# Altium schematic sheet Sheet1.SchDoc
size A3
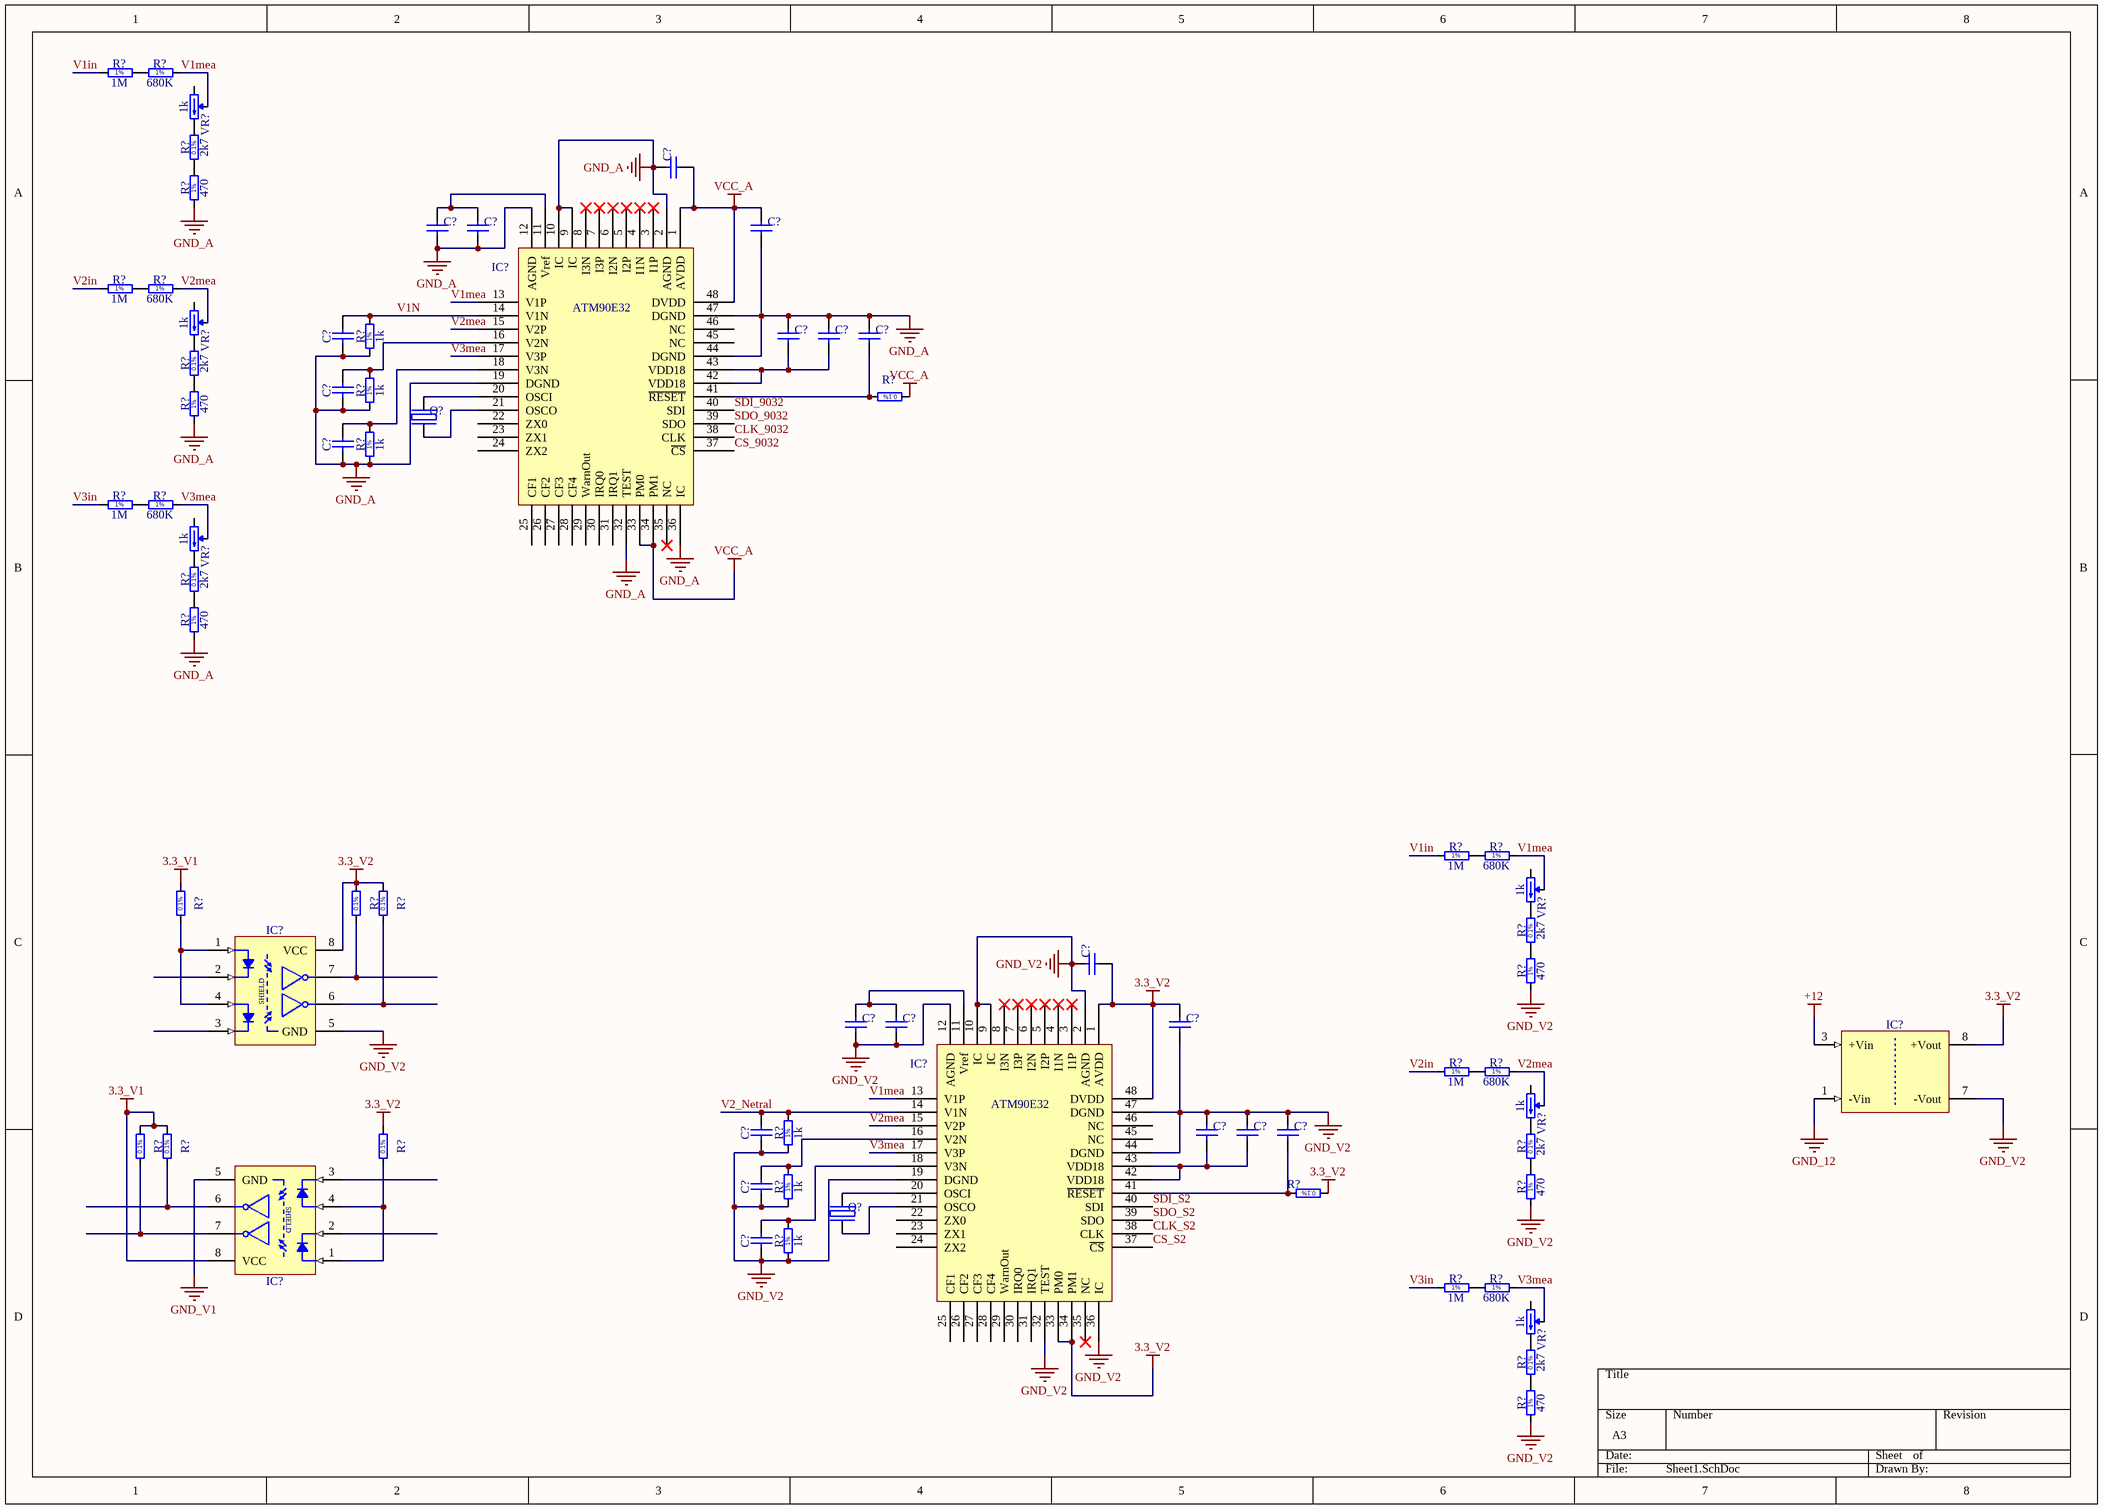
[diagram p0: Sheet1.SchDoc]

## Parts
(Parts that share a designator on the sheet are numbered #1, #2 ... from top to bottom, then left to right.)
C?#1  0.1uf  [CAPC2012X135N]  (value not drawn)
C?#2  0.1uf  [CAPC2012X135N]  (value not drawn)
C?#3  0.1uf  [CAPC2012X135N]  (value not drawn)
C?#4  4.7uf  [CAPC2012X135N]  (value not drawn)
C?#5  0.1uf  [CAPC2012X135N]  (value not drawn)
C?#6  0.1uf  [CAPC2012X135N]  (value not drawn)
C?#7  18nf  [CAPC2012X135N]  (value not drawn)
C?#8  10uf  [CAPC2012X135N]  (value not drawn)
C?#9  18nf  [CAPC2012X135N]  (value not drawn)
C?#10  18nf  [CAPC2012X135N]  (value not drawn)
C?#11  0.1uf  [CAPC2012X135N]  (value not drawn)
C?#12  0.1uf  [CAPC2012X135N]  (value not drawn)
C?#13  0.1uf  [CAPC2012X135N]  (value not drawn)
C?#14  4.7uf  [CAPC2012X135N]  (value not drawn)
C?#15  0.1uf  [CAPC2012X135N]  (value not drawn)
C?#16  0.1uf  [CAPC2012X135N]  (value not drawn)
C?#17  18nf  [CAPC2012X135N]  (value not drawn)
C?#18  10uf  [CAPC2012X135N]  (value not drawn)
C?#19  18nf  [CAPC2012X135N]  (value not drawn)
C?#20  18nf  [CAPC2012X135N]  (value not drawn)
IC?#1  ATM90E32  [48A_N]
IC?#2  HCPL-2631S  [SOIC254P1030X508-8N]  (value not drawn)
IC?#3  TES 1-0511  [DCDC_TRACO_TES1-XX1X]  (value not drawn)
IC?#4  ATM90E32  [48A_N]
IC?#5  HCPL-2631S  [SOIC254P1030X508-8N]  (value not drawn)
Q?#1  16.384Mhz  [XTAL1160X490X430]  (value not drawn)
Q?#2  16.384Mhz  [XTAL1160X490X430]  (value not drawn)
R?#1  1M  [RES1016-630X250]
R?#2  680K  [RES1016-630X250]
R?#3  2k7  [RESC2012X60N]
R?#4  470  [RESC2012X60N]
R?#5  1M  [RES1016-630X250]
R?#6  680K  [RES1016-630X250]
R?#7  1k  [RESC2012X60N]
R?#8  2k7  [RESC2012X60N]
R?#9  10k  [RESC2012X60N]  (value not drawn)
R?#10  1k  [RESC2012X60N]
R?#11  470  [RESC2012X60N]
R?#12  1k  [RESC2012X60N]
R?#13  1M  [RES1016-630X250]
R?#14  680K  [RES1016-630X250]
R?#15  2k7  [RESC2012X60N]
R?#16  470  [RESC2012X60N]
R?#17  1M  [RES1016-630X250]
R?#18  680K  [RES1016-630X250]
R?#19  10k  [RESC2012X60N]  (value not drawn)
R?#20  10k  [RESC2012X60N]  (value not drawn)
R?#21  10k  [RESC2012X60N]  (value not drawn)
R?#22  2k7  [RESC2012X60N]
R?#23  470  [RESC2012X60N]
R?#24  1M  [RES1016-630X250]
R?#25  680K  [RES1016-630X250]
R?#26  1k  [RESC2012X60N]
R?#27  10k  [RESC2012X60N]  (value not drawn)
R?#28  10k  [RESC2012X60N]  (value not drawn)
R?#29  10k  [RESC2012X60N]  (value not drawn)
R?#30  2k7  [RESC2012X60N]
R?#31  10k  [RESC2012X60N]  (value not drawn)
R?#32  1k  [RESC2012X60N]
R?#33  470  [RESC2012X60N]
R?#34  1k  [RESC2012X60N]
R?#35  1M  [RES1016-630X250]
R?#36  680K  [RES1016-630X250]
R?#37  2k7  [RESC2012X60N]
R?#38  470  [RESC2012X60N]
VR?#1  1k  [VR5]
VR?#2  1k  [VR5]
VR?#3  1k  [VR5]
VR?#4  1k  [VR5]
VR?#5  1k  [VR5]
VR?#6  1k  [VR5]

## Nets
3.3_V1: IC?#5.8(VCC) R?#19.2 R?#27.2 R?#28.2
3.3_V2: C?#11.2 C?#13.1 IC?#2.8(VCC) IC?#3.8(+Vout) IC?#4.1(AVDD) IC?#4.33(PM0) IC?#4.34(PM1) IC?#4.48(DVDD) R?#20.2 R?#21.2 R?#29.2 R?#31.1
+12: IC?#3.3(+Vin)
GND_12: IC?#3.1(-Vin)
GND_A: C?#1.1 C?#2.2 C?#3.2 C?#4.1 C?#5.1 C?#6.1 C?#7.1 C?#8.2 C?#9.1 C?#10.1 IC?#1.2(AGND) IC?#1.9(IC) IC?#1.10(IC) IC?#1.12(AGND) IC?#1.19(DGND) IC?#1.32(TEST) IC?#1.36(IC) IC?#1.44(DGND) IC?#1.47(DGND) R?#4.1 R?#7.1 R?#10.1 R?#11.1 R?#12.1 R?#16.1
GND_V1: IC?#5.5(GND)
GND_V2: C?#11.1 C?#12.2 C?#13.2 C?#14.1 C?#15.1 C?#16.1 C?#17.1 C?#18.2 C?#19.1 C?#20.1 IC?#2.5(GND) IC?#3.7(-Vout) IC?#4.2(AGND) IC?#4.9(IC) IC?#4.10(IC) IC?#4.12(AGND) IC?#4.19(DGND) IC?#4.32(TEST) IC?#4.36(IC) IC?#4.44(DGND) IC?#4.47(DGND) R?#23.1 R?#26.1 R?#32.1 R?#33.1 R?#34.1 R?#38.1
VCC_A: C?#1.2 C?#3.1 IC?#1.1(AVDD) IC?#1.33(PM0) IC?#1.34(PM1) IC?#1.48(DVDD) R?#9.1
CLK_9032: IC?#1.38(CLK)
CLK_S2: IC?#4.38(CLK)
CS_9032: IC?#1.37(~{CS})
CS_S2: IC?#4.37(~{CS})
SDI_9032: IC?#1.40(SDI)
SDI_S2: IC?#4.40(SDI)
SDO_9032: IC?#1.39(SDO)
SDO_S2: IC?#4.39(SDO)
V1in: R?#1.1 R?#17.1
V1mea: IC?#1.13(V1P) IC?#4.13(V1P) R?#2.2 R?#18.2 VR?#1.2(W) VR?#4.2(W)
V1N: C?#7.2 IC?#1.14(V1N) R?#7.2
V2_Netral: C?#17.2 IC?#4.14(V1N) R?#26.2
V2in: R?#5.1 R?#24.1
V2mea: IC?#1.15(V2P) IC?#4.15(V2P) R?#6.2 R?#25.2 VR?#2.2(W) VR?#5.2(W)
V3in: R?#13.1 R?#35.1
V3mea: IC?#1.17(V3P) IC?#4.17(V3P) R?#14.2 R?#36.2 VR?#3.2(W) VR?#6.2(W)
NetC?#2_1: C?#2.1 C?#4.2 IC?#1.11(Vref)
NetC?#5_2: C?#5.2 C?#8.1 IC?#1.42(VDD18) IC?#1.43(VDD18)
NetC?#6_2: C?#6.2 IC?#1.41(~{RESET}) R?#9.2
NetC?#9_2: C?#9.2 IC?#1.16(V2N) R?#10.2
NetC?#10_2: C?#10.2 IC?#1.18(V3N) R?#12.2
NetC?#12_1: C?#12.1 C?#14.2 IC?#4.11(Vref)
NetC?#15_2: C?#15.2 C?#18.1 IC?#4.42(VDD18) IC?#4.43(VDD18)
NetC?#16_2: C?#16.2 IC?#4.41(~{RESET}) R?#31.2
NetC?#19_2: C?#19.2 IC?#4.16(V2N) R?#32.2
NetC?#20_2: C?#20.2 IC?#4.18(V3N) R?#34.2
NetIC?#1_20: IC?#1.20(OSCI) Q?#1.1(OSC1)
NetIC?#1_21: IC?#1.21(OSCO) Q?#1.2(OSC2)
NetIC?#2_1: IC?#2.1(A1) IC?#2.4(A2) R?#19.1
NetIC?#2_6: IC?#2.6(VO2) R?#21.1
NetIC?#2_7: IC?#2.7(VO1) R?#20.1
NetIC?#4_20: IC?#4.20(OSCI) Q?#2.1(OSC1)
NetIC?#4_21: IC?#4.21(OSCO) Q?#2.2(OSC2)
NetIC?#5_1: IC?#5.1(A1) IC?#5.4(A2) R?#29.1
NetIC?#5_6: IC?#5.6(VO2) R?#28.1
NetIC?#5_7: IC?#5.7(VO1) R?#27.1
NetR?#1_2: R?#1.2 R?#2.1
NetR?#3_1: R?#3.1 R?#4.2
NetR?#3_2: R?#3.2 VR?#1.3(CW)
NetR?#5_2: R?#5.2 R?#6.1
NetR?#8_1: R?#8.1 R?#11.2
NetR?#8_2: R?#8.2 VR?#2.3(CW)
NetR?#13_2: R?#13.2 R?#14.1
NetR?#15_1: R?#15.1 R?#16.2
NetR?#15_2: R?#15.2 VR?#3.3(CW)
NetR?#17_2: R?#17.2 R?#18.1
NetR?#22_1: R?#22.1 R?#23.2
NetR?#22_2: R?#22.2 VR?#4.3(CW)
NetR?#24_2: R?#24.2 R?#25.1
NetR?#30_1: R?#30.1 R?#33.2
NetR?#30_2: R?#30.2 VR?#5.3(CW)
NetR?#35_2: R?#35.2 R?#36.1
NetR?#37_1: R?#37.1 R?#38.2
NetR?#37_2: R?#37.2 VR?#6.3(CW)

Not connected (* = marked no-connect by the designer): IC?#1 3(I1P)* 4(I1N)* 5(I2P)* 6(I2N)* 7(I3P)* 8(I3N)* 22(ZX0) 23(ZX1) 24(ZX2) 25(CF1) 26(CF2) 27(CF3) 28(CF4) 29(WarnOut) 30(IRQ0) 31(IRQ1) 35(NC)* 45(NC) 46(NC); IC?#2 2(C1) 3(C2); IC?#4 3(I1P)* 4(I1N)* 5(I2P)* 6(I2N)* 7(I3P)* 8(I3N)* 22(ZX0) 23(ZX1) 24(ZX2) 25(CF1) 26(CF2) 27(CF3) 28(CF4) 29(WarnOut) 30(IRQ0) 31(IRQ1) 35(NC)* 45(NC) 46(NC); IC?#5 2(C1) 3(C2); VR?#1 1(CCW); VR?#2 1(CCW); VR?#3 1(CCW); VR?#4 1(CCW); VR?#5 1(CCW); VR?#6 1(CCW)

## Notes on the sheet
- (in symbol HCPL-2631S) SHIELD
- (in symbol R0805_1K_1%_0.125W_100PPM) 1%
- (in symbol R0805_2K7_0.1%_0.125W_25PPM) 0.1%
- (in symbol R0805_10K_0.1%_0.1W_10PPM) 0.1%
- (in symbol R0805_470R_1%_0.125W_100PPM) 1%
- (in symbol RMF_1M_1%_0.6W_50PPM_1016-630X250) 1%
- (in symbol RMF_680K_1%_0.6W_50PPM_1016-630X250) 1%

## Library data of the parts
C?#1-C?#3 C?#5 C?#6 C?#11-C?#13 C?#15 C?#16 = CC0805_100NF_50V_10%_X7R: 0092-0004-8; Part Description: SMD Multilayer Chip Ceramic Capacitor; Manufacturer: GENERIC; Manufacturer1 Part Number: B37941K5104K62; Value: 100nF; Voltage: 50V; TC: X7R; Tolerance: ±10%; Table: Capacitors SMD; Part Number: CC0805_100NF_50V_10%_X7R; Component Kind: Standard; Component Type: Standard; Pin Count: 2; Status: Preferred; Manufacturer Part Number: CC0805_100NF_50V_10%_X7R; Case: 0805; Mounted: Yes; Socket: No; SMD: Yes; Manufacturer1 Example: EPCOS; Manufacturer1 ComponentHeight: 1.35mm; HelpURL: \\cern.ch\dfs\Applications\Altium\Datasheets\CC0805_X7R_EPCOS.pdf; Author: CERN DEM JLC; CreateDate: 3/12/2550; LatestRevisionDate: 3/12/2550
C?#4 C?#14 = CC0805_4.7UF_10V_10%_X5R: 0160-0457-5; Part Description: SMD Multilayer Chip Ceramic Capacitor; Manufacturer: GENERIC; Manufacturer1 Part Number: 222224013672; Voltage: 10V; TC: X5R; Tolerance: ±10%; Table: Capacitors SMD; Part Number: CC0805_4.7UF_10V_10%_X5R; Component Kind: Standard; Component Type: Standard; Pin Count: 2; Value: 4.7uF; Status: Preferred; Manufacturer Part Number: CC0805_4.7UF_10V_10%_X5R; Case: 0805; Mounted: Yes; Socket: No; SMD: Yes; Manufacturer1 Example: PHYCOMP; Manufacturer1 ComponentHeight: 1.45mm; HelpURL: \\cern.ch\dfs\Applications\Altium\Datasheets\CC0805_X5R_PHYCOMP_HC.pdf; Author: CERN DEM JLC; CreateDate: 3/12/2550; LatestRevisionDate: 3/12/2550
C?#7 C?#9 C?#10 C?#17 C?#19 C?#20 = CC0805_18NF_50V_10%_X7R: 0328-0120-2; Part Description: SMD Multilayer Chip Ceramic Capacitor; Manufacturer: GENERIC; Manufacturer1 Part Number: 223858615639; Voltage: 50V; TC: X7R; Tolerance: ±10%; Table: Capacitors SMD; Part Number: CC0805_18NF_50V_10%_X7R; Component Kind: Standard; Component Type: Standard; Pin Count: 2; Value: 18nF; Status: Preferred; Manufacturer Part Number: CC0805_18NF_50V_10%_X7R; Case: 0805; Mounted: Yes; Socket: No; SMD: Yes; Manufacturer1 Example: PHYCOMP; Manufacturer1 ComponentHeight: 1.35mm; HelpURL: \\cern.ch\dfs\Applications\Altium\Datasheets\CC0805_X7R_PHYCOMP.pdf; Author: CERN DEM JLC; CreateDate: 3/12/2550; LatestRevisionDate: 3/12/2550
C?#8 C?#18 = CC0805_10UF_10V_10%_X7R: 0328-0108-8; Part Description: SMD Multilayer Chip Ceramic Capacitor; Manufacturer: GENERIC; Manufacturer1 Part Number: GRM21BR71A106KE51L; Voltage: 10V; TC: X7R; Tolerance: ±10%; Table: Capacitors SMD; Part Number: CC0805_10UF_10V_10%_X7R; Component Kind: Standard; Component Type: Standard; Pin Count: 2; Value: 10uF; Status: Preferred; Manufacturer Part Number: CC0805_10UF_10V_10%_X7R; Case: 0805; Mounted: Yes; Socket: No; SMD: Yes; Manufacturer1 Example: MURATA; Manufacturer1 ComponentHeight: 1.35mm; HelpURL: \\cern.ch\dfs\Applications\Altium\Datasheets\CC0805_X7R_MURATA.pdf; Author: CERN DEM JLC; CreateDate: 30/4/2555; LatestRevisionDate: 30/4/2555
IC?#2 IC?#5 = HCPL-2631S: 0123-0634-1 HCPL2630SD Dual Optocoupler; Part Description: Dual-Channel High Speed 10 MBit/s Logic Gate Output Optocoupler; Manufacturer: FAIRCHILD SEMICONDUCTOR; Table: Optocouplers; Part Number: HCPL-2631S; Component Kind: Standard; Component Type: Standard; Device: HCPL-2631S; PackageDescription: DIP Gull Wing Surface Mount, 8-Leads, Body 9.9x6.9mm (max), Pitch 2.54mm, IPC Medium Density; Manufacturer Part Number: HCPL-2631S; Pin Count: 8; Case: DIP8 SMD; Mounted: Yes; Socket: No; SMD: Yes; ComponentHeight: 5.08mm; HelpURL: \\cern.ch\dfs\Applications\Altium\Datasheets\HCPL-2631S.pdf; Author: CERN DEM JLC; CreateDate: 20/5/2551; LatestRevisionDate: 20/5/2551
IC?#3 = TES 1-0511: 0658-0041-5 DC-DC Converter 3.3VDC/30mA-303mA,1W, / Isolated and Unregulated Single Output, / Fixed Input Voltage 12VDC; Part Description: 5V ±10% to 5V, Iout (max) 200mA, 1W DC-DC Converter; Manufacturer: TRACO POWER; Table: DC-DC Converters; Part Number: TES 1-0511; Component Kind: Standard; Component Type: Standard; Device: TES 1-0511; PackageDescription: TES 1 Series, Single Output DC/DC Converter,  Body 13.7x8mm; Manufacturer Part Number: TES 1-0511; Pin Count: 5; Mounted: Yes; Socket: No; SMD: Yes; ComponentHeight: 7.25mm; HelpURL: \\cern.ch\dfs\Applications\Altium\Datasheets\TES 1-0511.pdf; Author: CERN DEM JMW; CreateDate: 13/1/2554; LatestRevisionDate: 13/1/2554
Q?#1 Q?#2 = XTAL_6MHZ_RAKON_HC49/4H SMX_20/50/10/16: 0099-0185-7; Part Description: Tolerance:± 20ppm, Stability:± 50ppm, -10°C to +70°C, 16pF, Surface Mount Quartz Crystal, HC49/4HSMX Serie; Manufacturer: RAKON; Manufacturer Part Number: 6MHz HC49/4H SMX 20/50/10/16; Value: 6MHz; Table: Crystals & Oscillators; Part Number: XTAL_6MHZ_RAKON_HC49/4H SMX_20/50/10/16; Component Kind: Standard; Component Type: Standard; PackageDescription: HC49/4H SMX Case, SMD Cristal, Body 11.6x4.9mm; Pin Count: 2; Mounted: Yes; Socket: No; SMD: Yes; ComponentHeight: 4.3mm; HelpURL: \\cern.ch\dfs\Applications\Altium\Datasheets\XTAL_RAKON_HC49-4HSMX.pdf; Author: CERN DEM JMW; CreateDate: 7/10/2551; LatestRevisionDate: 3/6/2553
R?#1 R?#5 R?#13 R?#17 R?#24 R?#35 = RMF_1M_1%_0.6W_50PPM_1016-630X250: 0150-2831-6; Part Description: Leaded Metal Film Resistor; Manufacturer: GENERIC; Manufacturer1 Part Number: MBB02070C1004FCT00; Power: 0.6W; TC: ±50ppm/°C; Tolerance: ±1%; Table: Resistors THD; Part Number: RMF_1M_1%_0.6W_50PPM_1016-630X250; Component Kind: Standard; Component Type: Standard; Pin Count: 2; Value: 1M; Status: Preferred; Manufacturer Part Number: RMF_1M_1%_0.6W_50PPM_1016-630X250; Case: LS10.16 L6.3 x D2.5; Mounted: Yes; Socket: No; SMD: No; ComponentHeight: 2.5mm; Manufacturer1 Example: VISHAY BEYSCHLAG; Manufacturer1 ComponentHeight: 2.5mm; HelpURL: \\cern.ch\dfs\Applications\Altium\Datasheets\RMF_VISHAY_MBB0207.pdf; Author: CERN DEM JLC; CreateDate: 4/12/2550; LatestRevisionDate: 7/4/2551
R?#2 R?#6 R?#14 R?#18 R?#25 R?#36 = RMF_680K_1%_0.6W_50PPM_1016-630X250: 0150-0219-0; Part Description: Leaded Metal Film Resistor; Manufacturer: GENERIC; Manufacturer1 Part Number: MBB02070C6803FCT00; Power: 0.6W; TC: ±50ppm/°C; Tolerance: ±1%; Table: Resistors THD; Part Number: RMF_680K_1%_0.6W_50PPM_1016-630X250; Component Kind: Standard; Component Type: Standard; Pin Count: 2; Value: 680k; Status: Preferred; Manufacturer Part Number: RMF_680K_1%_0.6W_50PPM_1016-630X250; Case: LS10.16 L6.3 x D2.5; Mounted: Yes; Socket: No; SMD: No; ComponentHeight: 2.5mm; Manufacturer1 Example: VISHAY BEYSCHLAG; Manufacturer1 ComponentHeight: 2.5mm; HelpURL: \\cern.ch\dfs\Applications\Altium\Datasheets\RMF_VISHAY_MBB0207.pdf; Author: CERN DEM JLC; CreateDate: 4/12/2550; LatestRevisionDate: 7/4/2551
R?#3 R?#8 R?#15 R?#22 R?#30 R?#37 = R0805_2K7_0.1%_0.125W_25PPM: 0150-3998-7; Part Description: Thin Film Chip Resistor; Manufacturer: GENERIC; Manufacturer1 Part Number: ERA6AEB272V; Power: 0.125W; TC: ±25ppm; Tolerance: ±0.1%; Table: Resistors SMD; Part Number: R0805_2K7_0.1%_0.125W_25PPM; Component Kind: Standard; Component Type: Standard; Pin Count: 2; Value: 2k7; Status: Not recommended; Manufacturer Part Number: R0805_2K7_0.1%_0.125W_25PPM; Case: 0805; Mounted: Yes; Socket: No; SMD: Yes; Manufacturer1 Example: PANASONIC; Manufacturer1 ComponentHeight: 0.6mm; HelpURL: \\cern.ch\dfs\Applications\Altium\Datasheets\R0805_PANASONIC_ERA.pdf; Author: CERN DEM JLC; CreateDate: 25/10/2554; LatestRevisionDate: 25/10/2554
R?#4 R?#11 R?#16 R?#23 R?#33 R?#38 = R0805_470R_1%_0.125W_100PPM: 0150-1892-7; Part Description: General Purpose Thick Film Chip Resistor; Manufacturer: GENERIC; Manufacturer1 Part Number: NRC10F4700TRF; Power: 0.125W; TC: ±100ppm/°C; Tolerance: ±1%; Table: Resistors SMD; Part Number: R0805_470R_1%_0.125W_100PPM; Component Kind: Standard; Component Type: Standard; Pin Count: 2; Value: 470; Status: Preferred; Manufacturer Part Number: R0805_470R_1%_0.125W_100PPM; Case: 0805; Mounted: Yes; Socket: No; SMD: Yes; Manufacturer1 Example: NIC COMPONENT; Manufacturer1 ComponentHeight: 0.6mm; HelpURL: \\cern.ch\dfs\Applications\Altium\Datasheets\R0805_NIC_NRC.pdf; Author: CERN DEM JLC; CreateDate: 3/12/2550; LatestRevisionDate: 13/3/2551
R?#7 R?#10 R?#12 R?#26 R?#32 R?#34 = R0805_1K_1%_0.125W_100PPM: 0176-0313-5; Part Description: General Purpose Thick Film Chip Resistor; Manufacturer: GENERIC; Manufacturer1 Part Number: NRC10F1001TRF; Power: 0.125W; TC: ±100ppm/°C; Tolerance: ±1%; Table: Resistors SMD; Part Number: R0805_1K_1%_0.125W_100PPM; Component Kind: Standard; Component Type: Standard; Pin Count: 2; Value: 1k; Status: Preferred; Manufacturer Part Number: R0805_1K_1%_0.125W_100PPM; Case: 0805; Mounted: Yes; Socket: No; SMD: Yes; Manufacturer1 Example: NIC COMPONENT; Manufacturer1 ComponentHeight: 0.6mm; HelpURL: \\cern.ch\dfs\Applications\Altium\Datasheets\R0805_NIC_NRC.pdf; Author: CERN DEM JLC; CreateDate: 3/12/2550; LatestRevisionDate: 13/3/2551
R?#9 R?#19-R?#21 R?#27-R?#29 R?#31 = R0805_10K_0.1%_0.1W_10PPM: 0176-0426-3; Part Description: Thin Film Chip Resistor; Manufacturer: GENERIC; Manufacturer1 Part Number: RN73C2A10KBTG; Power: 0.1W; TC: ±10ppm; Tolerance: ±0.1%; Table: Resistors SMD; Part Number: R0805_10K_0.1%_0.1W_10PPM; Component Kind: Standard; Component Type: Standard; Pin Count: 2; Value: 10k; Status: Not recommended; Manufacturer Part Number: R0805_10K_0.1%_0.1W_10PPM; Case: 0805; Mounted: Yes; Socket: No; SMD: Yes; Manufacturer1 Example: TYCO HOLSWORTHY; Manufacturer1 ComponentHeight: 0.6mm; HelpURL: \\cern.ch\dfs\Applications\Altium\Datasheets\R0805_Tyco_RN73.pdf; Author: CERN DEM JLC; CreateDate: 3/12/2550; LatestRevisionDate: 13/3/2551
VR?#1-VR?#6 = TRIM_12T_100K_BOURNS_3266W-1-104LF: 0141-0164-9; Part Description: 12 Turn Trimming Potentiometer (Top Adjustement); Manufacturer: BOURNS; Value: 100k; Power: 0.25W; TC: ?100ppm/?C; Tolerance: ?10%; Table: Potentiometers THD; Part Number: TRIM_12T_100K_BOURNS_3266W-1-104LF; Component Kind: Standard; Component Type: Standard; Footprint: TRIM_BOURNS_3266W; Pin Count: 3; Manufacturer Part Number: 3266W-1-104LF; Case: 3266W; Mounted: Yes; Socket: No; SMD: No; ComponentHeight: 7.75mm; HelpURL: \\cern.ch\dfs\Applications\Altium\Datasheets\TRIM_BOURNS_3266W.pdf; Author: CERN DEM JLC; CreateDate: 10/6/2551; LatestRevisionDate: 28/11/2555